# EAGLE design Harp Motor H2-module v1.0 (EAGLE 9.6.2)
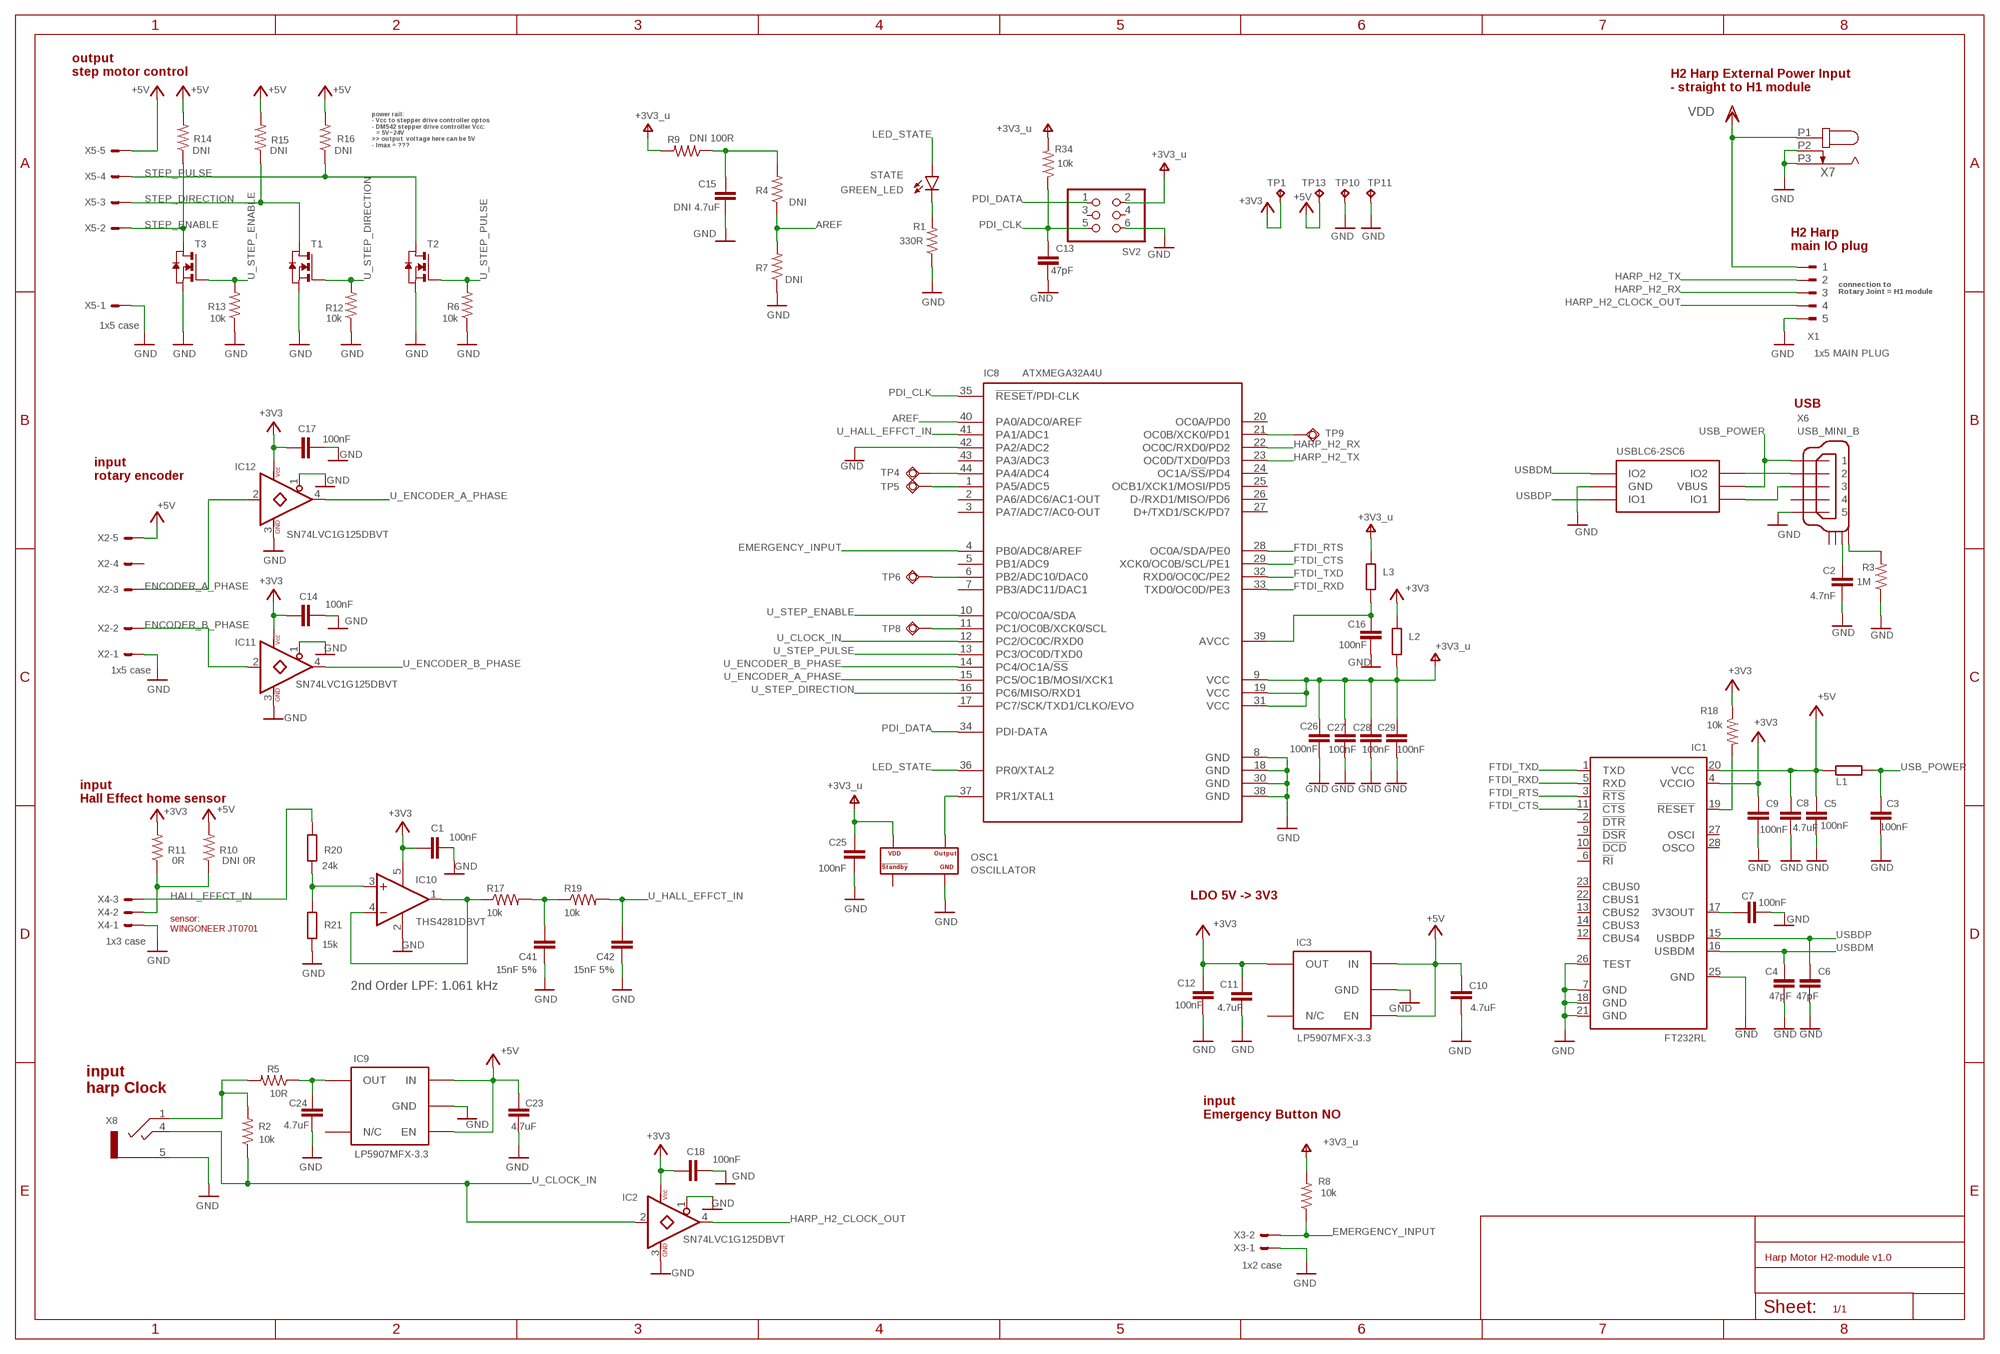
[diagram p0: schematic, sheet 1]

## Parts
C1  100nF  C-EUC0402K  [C0402K]
C2  4.7nF  C-EUC0402K  [C0402K]
C3  100nF  C-EUC0402K  [C0402K]
C4  47pF  C-EUC0402K  [C0402K]
C5  100nF  C-EUC0402K  [C0402K]
C6  47pF  C-EUC0402K  [C0402K]
C7  100nF  C-EUC0402K  [C0402K]
C8  4.7uF  C-EUC0603K  [C0603K]
C9  100nF  C-EUC0402K  [C0402K]
C10  4.7uF  C-EUC0603K  [C0603K]
C11  4.7uF  C-EUC0603K  [C0603K]
C12  100nF  C-EUC0402K  [C0402K]
C13  47pF  C-EUC0402K  [C0402K]
C14  100nF  C-EUC0402K  [C0402K]
C15  DNI 4.7uF  C-EUC0603K  [C0603K]
C16  100nF  C-EUC0402K  [C0402K]
C17  100nF  C-EUC0402K  [C0402K]
C18  100nF  C-EUC0402K  [C0402K]
C23  4.7uF  C-EUC0603K  [C0603K]
C24  4.7uF  C-EUC0603K  [C0603K]
C25  100nF  C-EUC0402K  [C0402K]
C26  100nF  C-EUC0402K  [C0402K]
C27  100nF  C-EUC0402K  [C0402K]
C28  100nF  C-EUC0402K  [C0402K]
C29  100nF  C-EUC0402K  [C0402K]
C41  15nF 5%  C-EUC0402K  [C0402K]
C42  15nF 5%  C-EUC0402K  [C0402K]
IC1  FT232RL  [SSOP28]
IC2  SN74LVC1G125DBVT  74LVC1G125DBV  [SOT23-5]
IC3  LP5907MFX-3.3  TLV700XX  [TSOT23-5]
IC7  USBLC6-2SC6  [SOT23-6L]
IC8  ATXMEGA32A4U  XMEGA-A4_AT-XMEGA-XXA4-AUTQFP44  [TQFP44]
IC9  LP5907MFX-3.3  TLV700XX  [TSOT23-5]
IC10  THS4281DBVT  OPA365  [SOT23-5]
IC11  SN74LVC1G125DBVT  74LVC1G125DBV  [SOT23-5]
IC12  SN74LVC1G125DBVT  74LVC1G125DBV  [SOT23-5]
L1  40R@100MHz  R-EU_R0805  [R0805]
L2  40R@100MHz  R-EU_R0805  [R0805]
L3  40R@100MHz  R-EU_R0805  [R0805]
OSC1  OSCILLATOR  [OSCILLATOR_3.2X2.5]
R1  330R  R-US_R0402  [R0402]
R2  10k  R-US_R0402  [R0402]
R3  1M  R-US_R0402  [R0402]
R4  DNI  R-US_R0402  [R0402]
R5  10R  R-US_R0402  [R0402]
R6  10k  R-US_R0402  [R0402]
R7  DNI  R-US_R0402  [R0402]
R8  10k  R-US_R0402  [R0402]
R9  DNI 100R  R-US_R0402  [R0402]
R10  DNI 0R  R-US_R0402  [R0402]
R11  0R  R-US_R0402  [R0402]
R12  10k  R-US_R0402  [R0402]
R13  10k  R-US_R0402  [R0402]
R14  DNI  R-US_R0402  [R0402]
R15  DNI  R-US_R0402  [R0402]
R16  DNI  R-US_R0402  [R0402]
R17  10k  R-US_R0402  [R0402]
R18  10k  R-US_R0402  [R0402]
R19  10k  R-US_R0402  [R0402]
R20  24k  R-EU_R0402  [R0402]
R21  15k  R-EU_R0402  [R0402]
R34  10k  R-US_R0402  [R0402]
STATE  GREEN_LED  LEDCHIP-LED0603  [CHIP-LED0603]
SV2  PINHD-2X3  [2X03]
T1  DMG1012UW  DMG1012UW-7  [SOT323]
T2  DMG1012UW  DMG1012UW-7  [SOT323]
T3  DMG1012UW  DMG1012UW-7  [SOT323]
TP1  NO_COMPONENT  TPB1,27  [B1,27]
TP4  NO_COMPONENT  TPSQTP11R  [TP11R]
TP5  NO_COMPONENT  TPSQTP11R  [TP11R]
TP6  NO_COMPONENT  TPSQTP11R  [TP11R]
TP8  NO_COMPONENT  TPSQTP11R  [TP11R]
TP9  NO_COMPONENT  TPSQTP11R  [TP11R]
TP10  NO_COMPONENT  TPB1,27  [B1,27]
TP11  NO_COMPONENT  TPB1,27  [B1,27]
TP13  NO_COMPONENT  TPB1,27  [B1,27]
X1  1x5 MAIN PLUG  90G-5  [90G-5]
X2  1x5 case  22-23-2051  [22-23-2051]
X3  1x2 case  22-23-2021  [22-23-2021]
X4  1x3 case  22-23-2031  [22-23-2031]
X5  1x5 case  22-23-2051  [22-23-2051]
X6  USB_MINI_B  [240-0002-1]
X7  DC_JACK2.1MM  [DC_POWER_INPUT_2.1MM]
X8  CLCK_JACK  STEREO_JACK  [35RASMT2BHNTRX]

## Nets
+3V3: C1.1 C9.1 C11.1 C12.1 C14.1 C17.1 C18.1 IC1.4(VCCIO) IC2.5(VCC) IC3.5(OUT) IC10.5(V+) IC11.5(VCC) IC12.5(VCC) L2.2 R11.2 R18.1 TP1.TP
+5V: C5.1 C8.1 C10.1 C23.1 IC1.20(VCC) IC3.1(IN) IC3.3(EN) IC9.1(IN) IC9.3(EN) L1.1 R10.2 R14.2 R15.2 R16.2 TP13.TP X2.5 X5.5
AREF: IC8.40(PA0/ADC0/AREF) R4.1 R7.2
EMERGENCY_INPUT: IC8.4(PB0/ADC8/AREF) R8.1 X3.2
ENCODER_A_PHASE: IC12.2(I) X2.3
ENCODER_B_PHASE: IC11.2(I) X2.2
FTDI_CTS: IC1.11(!CTS) IC8.29(XCK0/OC0B/SCL/PE1)
FTDI_RTS: IC1.3(!RTS) IC8.28(OC0A/SDA/PE0)
FTDI_RXD: IC1.5(RXD) IC8.33(TXD0/OC0D/PE3)
FTDI_TXD: IC1.1(TXD) IC8.32(RXD0/OC0C/PE2)
GND: C1.2 C2.2 C3.2 C4.2 C5.2 C6.2 C7.2 C8.2 C9.2 C10.2 C11.2 C12.2 C13.2 C14.2 C15.2 C16.2 C17.2 C18.2 C23.2 C24.2 C25.2 C26.2 C27.2 C28.2 C29.2 C41.1 C42.1 IC1.7(GND) IC1.18(GND) IC1.21(GND) IC1.25(GND) IC1.26(TEST) IC2.1(OE) IC2.3(GND) IC3.2(GND) IC7.P$2(GND) IC8.8(GND) IC8.18(GND) IC8.30(GND) IC8.38(GND) IC8.42(PA2/ADC2) IC9.2(GND) IC10.2(V-) IC11.1(OE) IC11.3(GND) IC12.1(OE) IC12.3(GND) OSC1.P$2(GND) R1.1 R3.1 R6.1 R7.1 R12.1 R13.1 R21.1 SV2.6 T1.2(S) T2.2(S) T3.2(S) TP10.TP TP11.TP X1.5 X2.1 X3.1 X4.1 X5.1 X6.P$5 X7.P2 X7.P3 X8.5
HALL_EFFCT_IN: R20.2 X4.3
HARP_H2_CLOCK_OUT: IC2.4(O) X1.4
HARP_H2_RX: IC8.22(OC0C/RXD0/PD2) X1.3
HARP_H2_TX: IC8.23(OC0D/TXD0/PD3) X1.2
LED_STATE: IC8.36(PR0/XTAL2) STATE.A
N$1: R3.2 X6.SHIELD_4
N$2: IC7.P$4(IO2) X6.P$2
N$3: IC7.P$6(IO1) X6.P$3
N$9: R1.2 STATE.C
N$11: IC8.44(PA4/ADC4) TP4.TP
N$12: IC8.1(PA5/ADC5) TP5.TP
N$13: IC8.6(PB2/ADC10/DAC0) TP6.TP
N$15: C2.1 X6.SHIELD_3
N$17: IC8.11(PC1/OC0B/XCK0/SCL) TP8.TP
N$18: IC8.21(OC0B/XCK0/PD1) TP9.TP
N$38: C7.1 IC1.17(3V3OUT)
N$50: C41.2 R17.2 R19.1
N$51: R10.1 R11.1 X4.2
N$62: C15.1 R4.2 R9.1
N$63: C16.1 IC8.39(AVCC) L3.1
N$64: IC10.1(OUT) IC10.4(-IN) R17.1
N$65: IC10.3(+IN) R20.1 R21.2
N$103: R2.2 R5.2 X8.1
N$104: C24.1 IC9.5(OUT) R5.1
N$175: IC1.19(!RESET) R18.2
OSC2: IC8.37(PR1/XTAL1) OSC1.P$3(OUTPUT)
PDI_CLK: C13.1 IC8.35(!RESET!/PDI-CLK) R34.1 SV2.5
PDI_DATA: IC8.34(PDI-DATA) SV2.1
STEP_DIRECTION: R15.1 T1.3(D) X5.3
STEP_ENABLE: R14.1 T3.3(D) X5.2
STEP_PULSE: R16.1 T2.3(D) X5.4
U_CLOCK_IN: IC2.2(I) IC8.12(PC2/OC0C/RXD0) R2.1 X8.4
U_ENCODER_A_PHASE: IC8.15(PC5/OC1B/MOSI/XCK1) IC12.4(O)
U_ENCODER_B_PHASE: IC8.14(PC4/OC1A/!SS) IC11.4(O)
U_HALL_EFFCT_IN: C42.2 IC8.41(PA1/ADC1) R19.2
U_STEP_DIRECTION: IC8.16(PC6/MISO/RXD1) R12.2 T1.1(G)
U_STEP_ENABLE: IC8.10(PC0/OC0A/SDA) R13.2 T3.1(G)
U_STEP_PULSE: IC8.13(PC3/OC0D/TXD0) R6.2 T2.1(G)
USB_POWER: C3.1 IC7.P$5(VBUS) L1.2 X6.P$1
USBDM: C4.1 IC1.16(USBDM) IC7.P$3(IO2)
USBDP: C6.1 IC1.15(USBDP) IC7.P$1(IO1)
V+: C25.1 C26.1 C27.1 C28.1 C29.1 IC8.9(VCC) IC8.19(VCC) IC8.31(VCC) L2.1 L3.2 OSC1.P$4(VDD) R8.2 R9.2 R34.2 SV2.2 ; supply symbol labelled +3V3_u
VDD: X1.1 X7.P1
Unconnected: IC1.2(!DTR) IC1.6(!RI) IC1.9(!DSR) IC1.10(!DCD) IC1.12(CBUS4) IC1.13(CBUS2) IC1.14(CBUS3) IC1.22(CBUS1) IC1.23(CBUS0) IC1.27(OSCI) IC1.28(OSCO) IC3.4(N/C) IC8.2(PA6/ADC6/AC1-OUT) IC8.3(PA7/ADC7/AC0-OUT) IC8.5(PB1/ADC9) IC8.7(PB3/ADC11/DAC1) IC8.17(PC7/SCK/TXD1/CLKO/EVO) IC8.20(OC0A/PD0) IC8.24(OC1A/!SS!/PD4) IC8.25(OCB1/XCK1/MOSI/PD5) IC8.26(D-/RXD1/MISO/PD6) IC8.27(D+/TXD1/SCK/PD7) IC8.43(PA3/ADC3) IC9.4(N/C) OSC1.P$1(STANDBY#) SV2.3 SV2.4 X2.4 X6.P$4 X6.SHIELD_1 X6.SHIELD_2

## Notes on the sheet
- output
  step motor control
- H2 Harp External Power Input
  - straight to H1 module
- power rail:
  - Vcc to stepper drive controller optos
  - DM542 stepper drive controller Vcc: 
     = 5V~24V
  >> output  voltage here can be 5V
  - Imax = ???
- H2 Harp 
  main IO plug
- connection to 
  Rotary Joint = H1 module
- USB
- input
  rotary encoder
- input
  Hall Effect home sensor
- LDO 5V -> 3V3
- sensor:
  WINGONEER JT0701
- 2nd Order LPF: 1.061 kHz
- input
  harp Clock
- input
  Emergency Button NO

## Library data of the parts
C1 C3 C5 C7 C9 C12 C14 C16-C18 C25-C29 = Harp Motor H2-module v1.0:C-EU: CAPACITOR, European symbol; MPN: C1005X7R1H104K050BB; OEPS: OEPS010004
C2 = Harp Motor H2-module v1.0:C-EU: CAPACITOR, European symbol; MPN: CC0402KRX7R8BB472; OEPS: OEPS010001
C4 C6 C13 = Harp Motor H2-module v1.0:C-EU: CAPACITOR, European symbol; MPN: 04025A470JAT2A; OEPS: OEPS010011
C8 C10 C11 C15 C23 C24 = Harp Motor H2-module v1.0:C-EU: CAPACITOR, European symbol; MPN: C1608X6S1C475K080AC; OEPS: OEPS010018
C41 C42 = Harp Motor H2-module v1.0:C-EU: CAPACITOR, European symbol; MPN: CGA2B3X7R1V153K050BB; OEPS: OEPS010023
IC1 = Harp Motor H2-module v1.0:FT232R: UART/FIFO IC; MPN: FT232RL; OEPS: OEPS080013
IC2 IC11 IC12 = Harp Motor H2-module v1.0:74*1G125: Single Bus Buffer Gate with 3-State Output; MPN: SN74LVC1G125DBVT; OEPS: OEPS080029
IC3 IC9 = Harp Motor H2-module v1.0:TLV700XX: C REG LINEAR 3.3V 200MA SOT23-5; MPN: LP5907MFX-3.3/NOPB; OEPS: OEPS080016
IC7 = Harp Motor H2-module v1.0:USBLC6-2SC6: TVS DIODE 5.25VWM 17VC SOT23-6; MPN: USBLC6-2SC6; OEPS: OEPS030010
IC8 = Harp Motor H2-module v1.0:XMEGA-A4_AT-XMEGA-XXA4-AU: ATxMega a4 Serie; MPN: ATXMEGA32A4U-AUR; OEPS: OEPS080012
IC10 = Harp Motor H2-module v1.0:OPA365; MPN: THS4281DBVT; OEPS: OEPS080038
L1-L3 = Harp Motor H2-module v1.0:R-EU_: RESISTOR, European symbol; MPN: MI0805K400R-10; OEPS: OEPS040003
OSC1 = Harp Motor H2-module v1.0:OSCILLATOR: XTAL OSC TCXO 32.0000MHZ HCMOS; MPN: DSC1001CI5-032.0000; OEPS: OEPS080018
R1 = Harp Motor H2-module v1.0:R-US_: RESISTOR, American symbol; MPN: RC0402FR-07330RL; OEPS: OEPS020037
R2 R6 R8 R12 R13 R17-R19 R34 = Harp Motor H2-module v1.0:R-US_: RESISTOR, American symbol; MPN: CRCW040210K0FKED; OEPS: OEPS020030
R3 = Harp Motor H2-module v1.0:R-US_: RESISTOR, American symbol; MPN: CRCW04021M00FKED; OEPS: OEPS020026
R4 R7 R14-R16 = Harp Motor H2-module v1.0:R-US_: RESISTOR, American symbol; MPN: DNI; OEPS: DNI
R5 = Harp Motor H2-module v1.0:R-US_: RESISTOR, American symbol; MPN: ERJ-PA2J100X; OEPS: OEPS020041
R9 = Harp Motor H2-module v1.0:R-US_: RESISTOR, American symbol; MPN: ERJ-2RKF1000X; OEPS: OEPS020004
R10 R11 = Harp Motor H2-module v1.0:R-US_: RESISTOR, American symbol; MPN: RC0402JR-070RL; OEPS: OEPS020001
R20 = Harp Motor H2-module v1.0:R-EU_: RESISTOR, European symbol; MPN: ERJ-2RKF2402X; OEPS: OEPS020048
R21 = Harp Motor H2-module v1.0:R-EU_: RESISTOR, European symbol; MPN: ERJ-2RKF1502X; OEPS: OEPS020015
STATE = Harp Motor H2-module v1.0:LED; MPN: LTST-C191KGKT; OEPS: OEPS030005
SV2 = Harp Motor H2-module v1.0:PINHD-2X3: PIN HEADER; MPN: 609-3210-ND; OEPS: OEPS070015
T1-T3 = Harp Motor H2-module v1.0:DMG1012UW-7: N-CHANNEL ENHANCEMENT MODE MOSFET; MPN: DMG1012UW-7; OEPS: OEPS060010
TP1 TP10 TP11 TP13 = Harp Motor H2-module v1.0:TP: Test pad
TP4-TP6 TP8 TP9 = Harp Motor H2-module v1.0:TPSQ: Test pad
X1 = Harp Motor H2-module v1.0:90G-5: WEIDMUELLER CLAMP CONNECTOR; MPN: 20.155MH/5-E; OEPS: OEPS070037
X2 X5 = Harp Motor H2-module v1.0:22-23-2051: .100" (2.54mm) Center Header - 5 Pin; MPN: 282834-5; OEPS: OEPS070041
X3 = Harp Motor H2-module v1.0:22-23-2021: .100" (2.54mm) Center Header - 2 Pin; MPN: 282834-2; OEPS: OEPS070020
X4 = Harp Motor H2-module v1.0:22-23-2031: .100" (2.54mm) Center Header - 3 Pin; MPN: 282834-3; OEPS: OEPS070035
X6 = Harp Motor H2-module v1.0:USB_MINI_B: CONN RCPT USB2.0 MINI B SMD R/A; MPN: UX60-MB-5S8; OEPS: OEPS070021
X7 = Harp Motor H2-module v1.0:DC_JACK: DC Power Connectors PCB 2.1MM; MPN: 163-179PH-EX; OEPS: OEPS070026
X8 = Harp Motor H2-module v1.0:STEREO_JACK: CONN JACK STEREO 3.5MM SMD R/A; MPN: 35RASMT2BHNTRX; OEPS: OEPS070025

## Net classes
0 default: clearance 0.205 mm

## Board
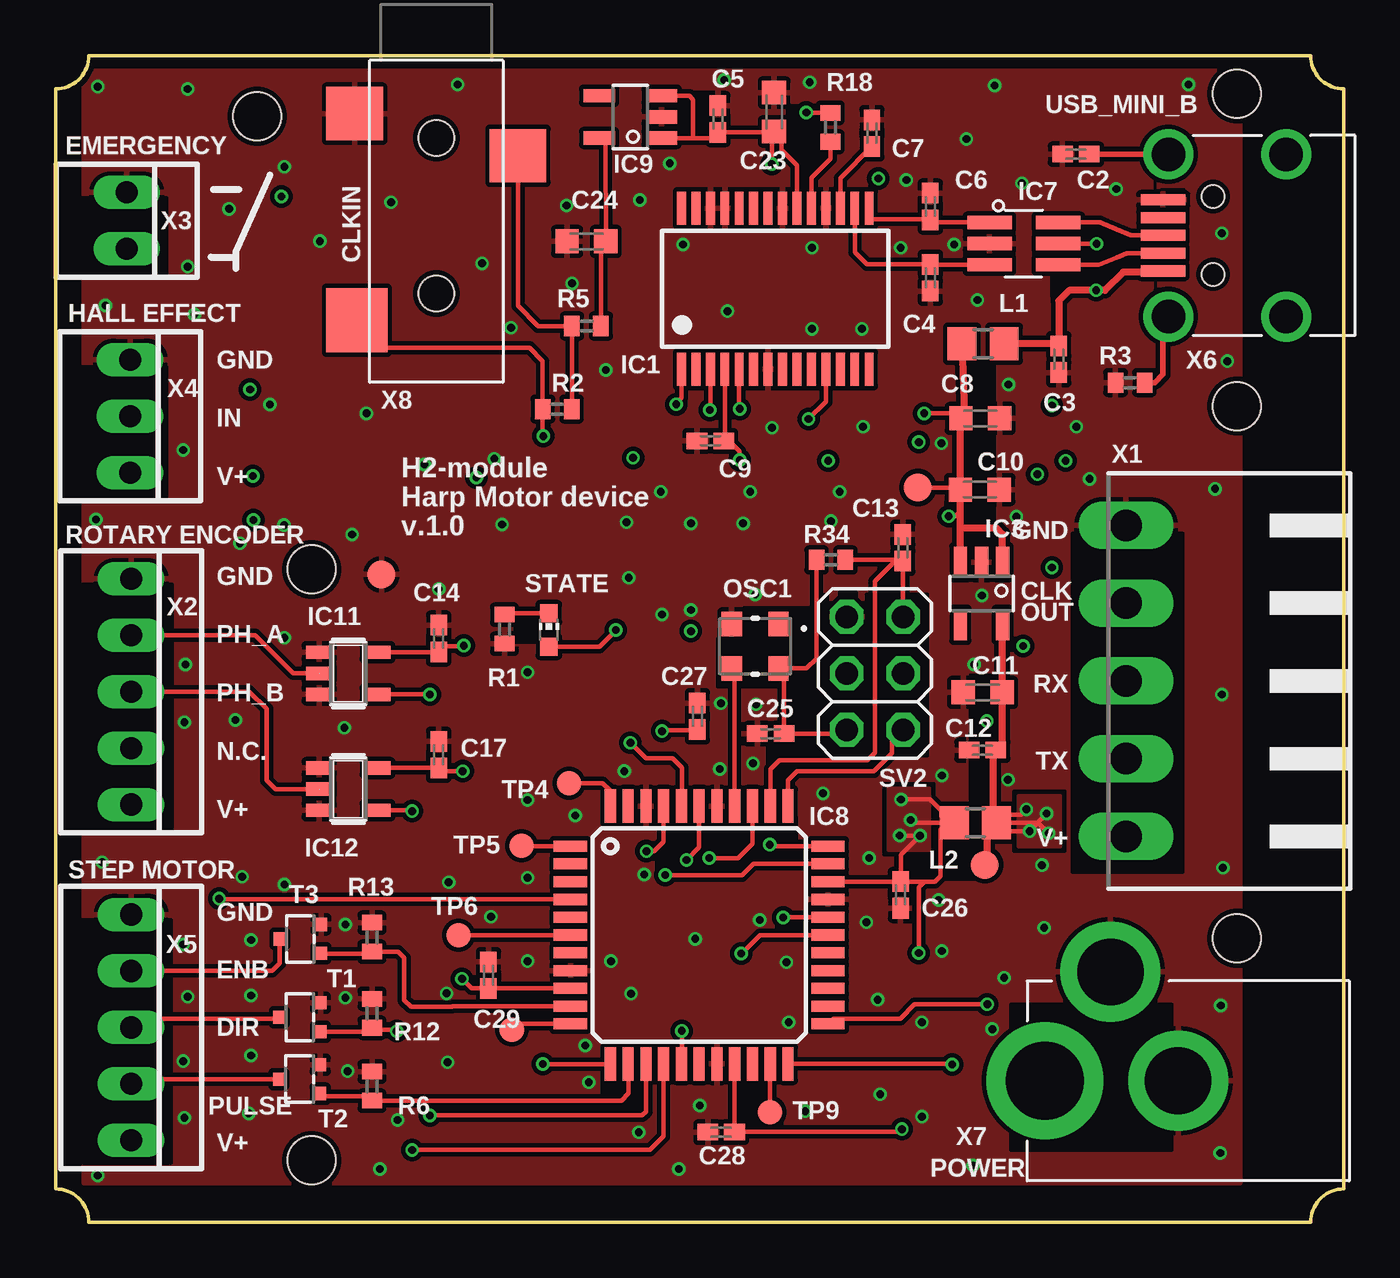
[diagram p1: board, top side]
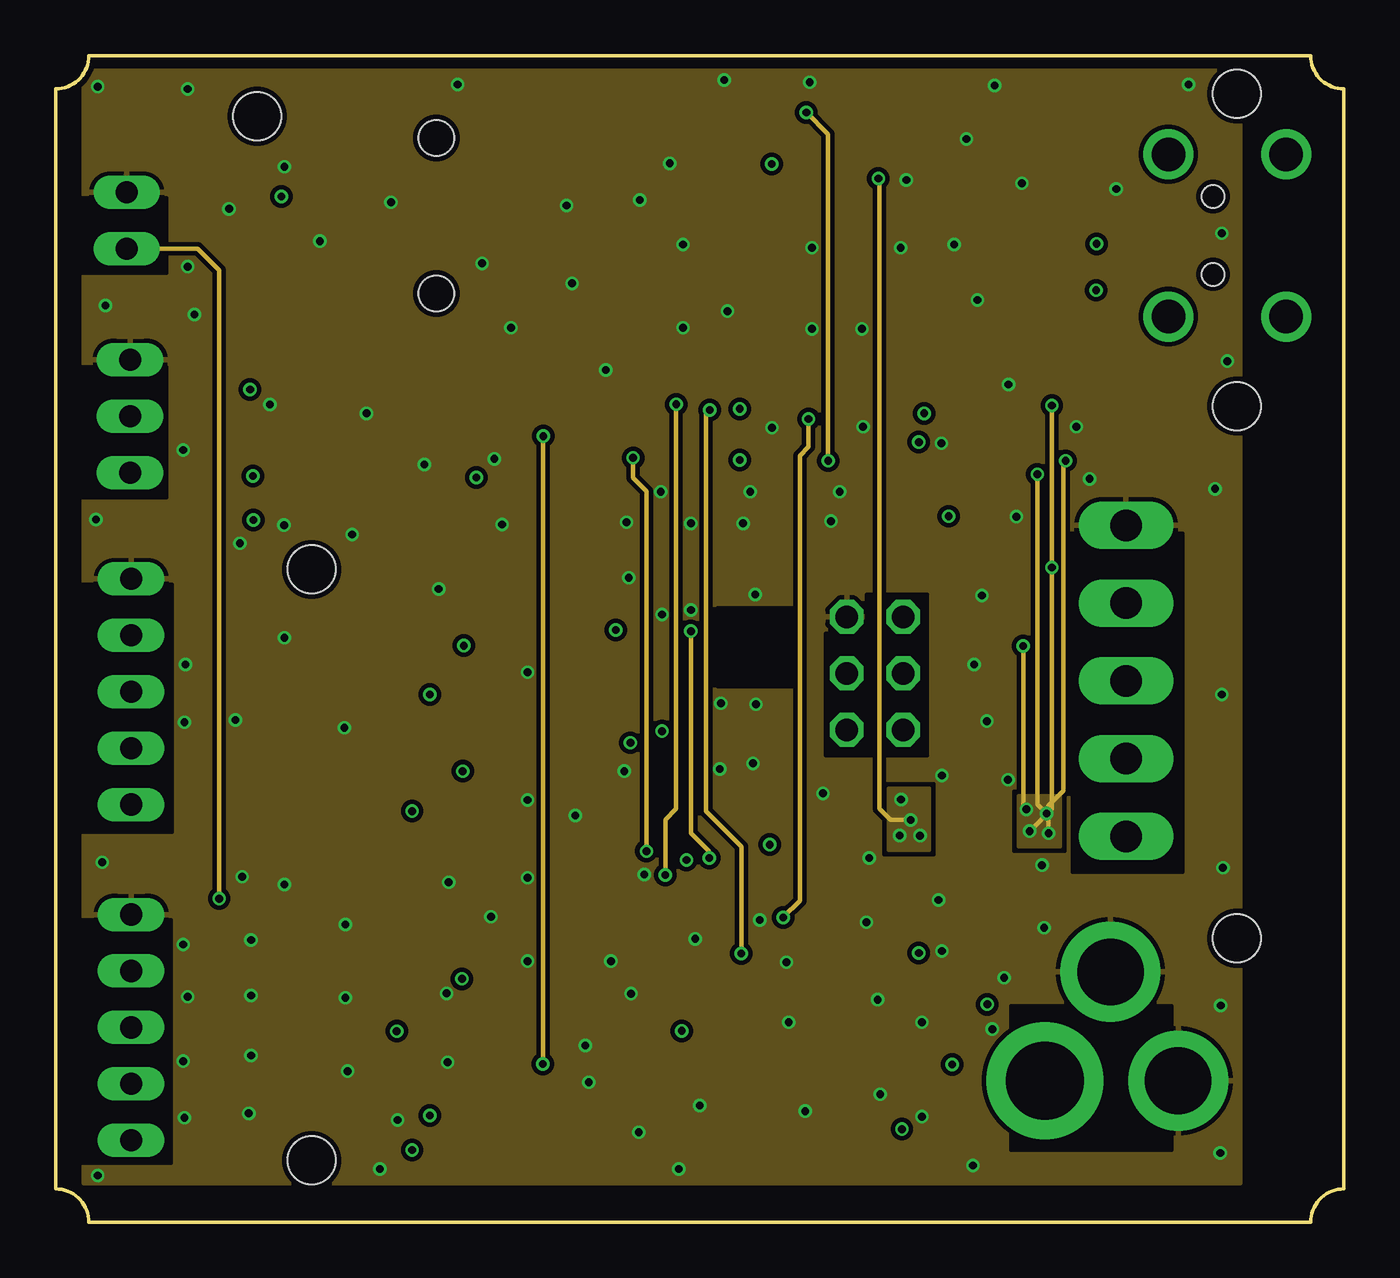
[diagram p2: board, inner layer Route2]
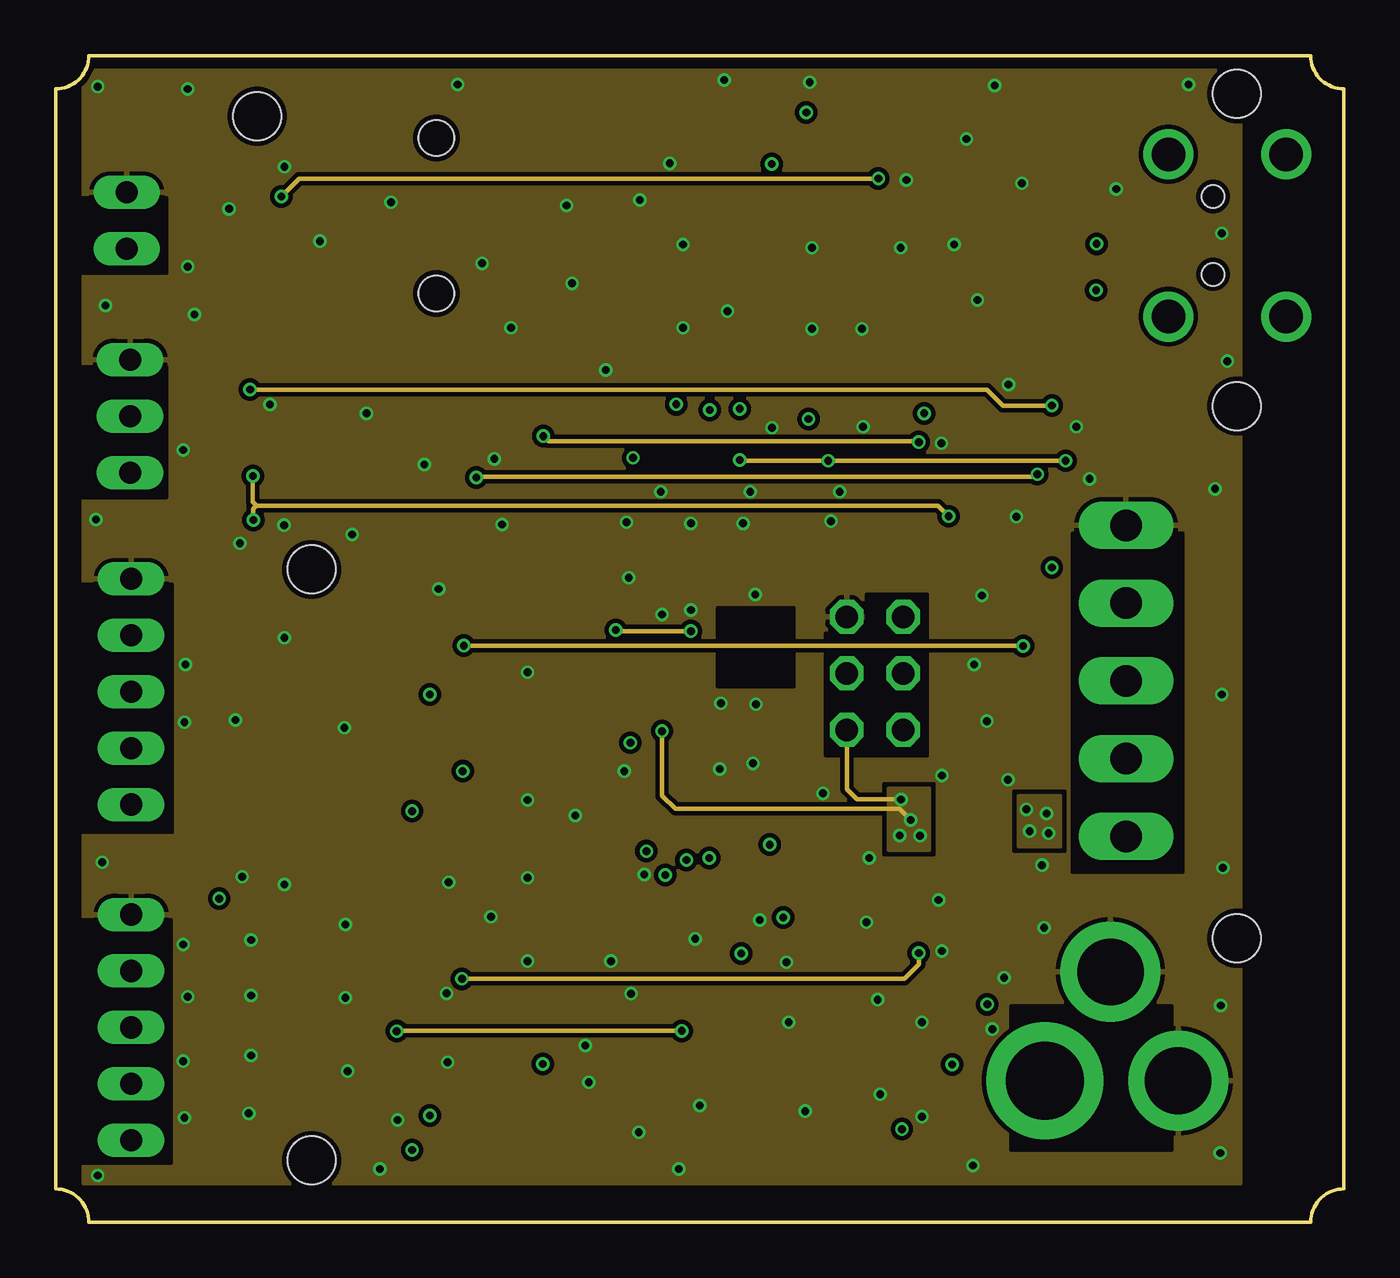
[diagram p3: board, inner layer Route15]
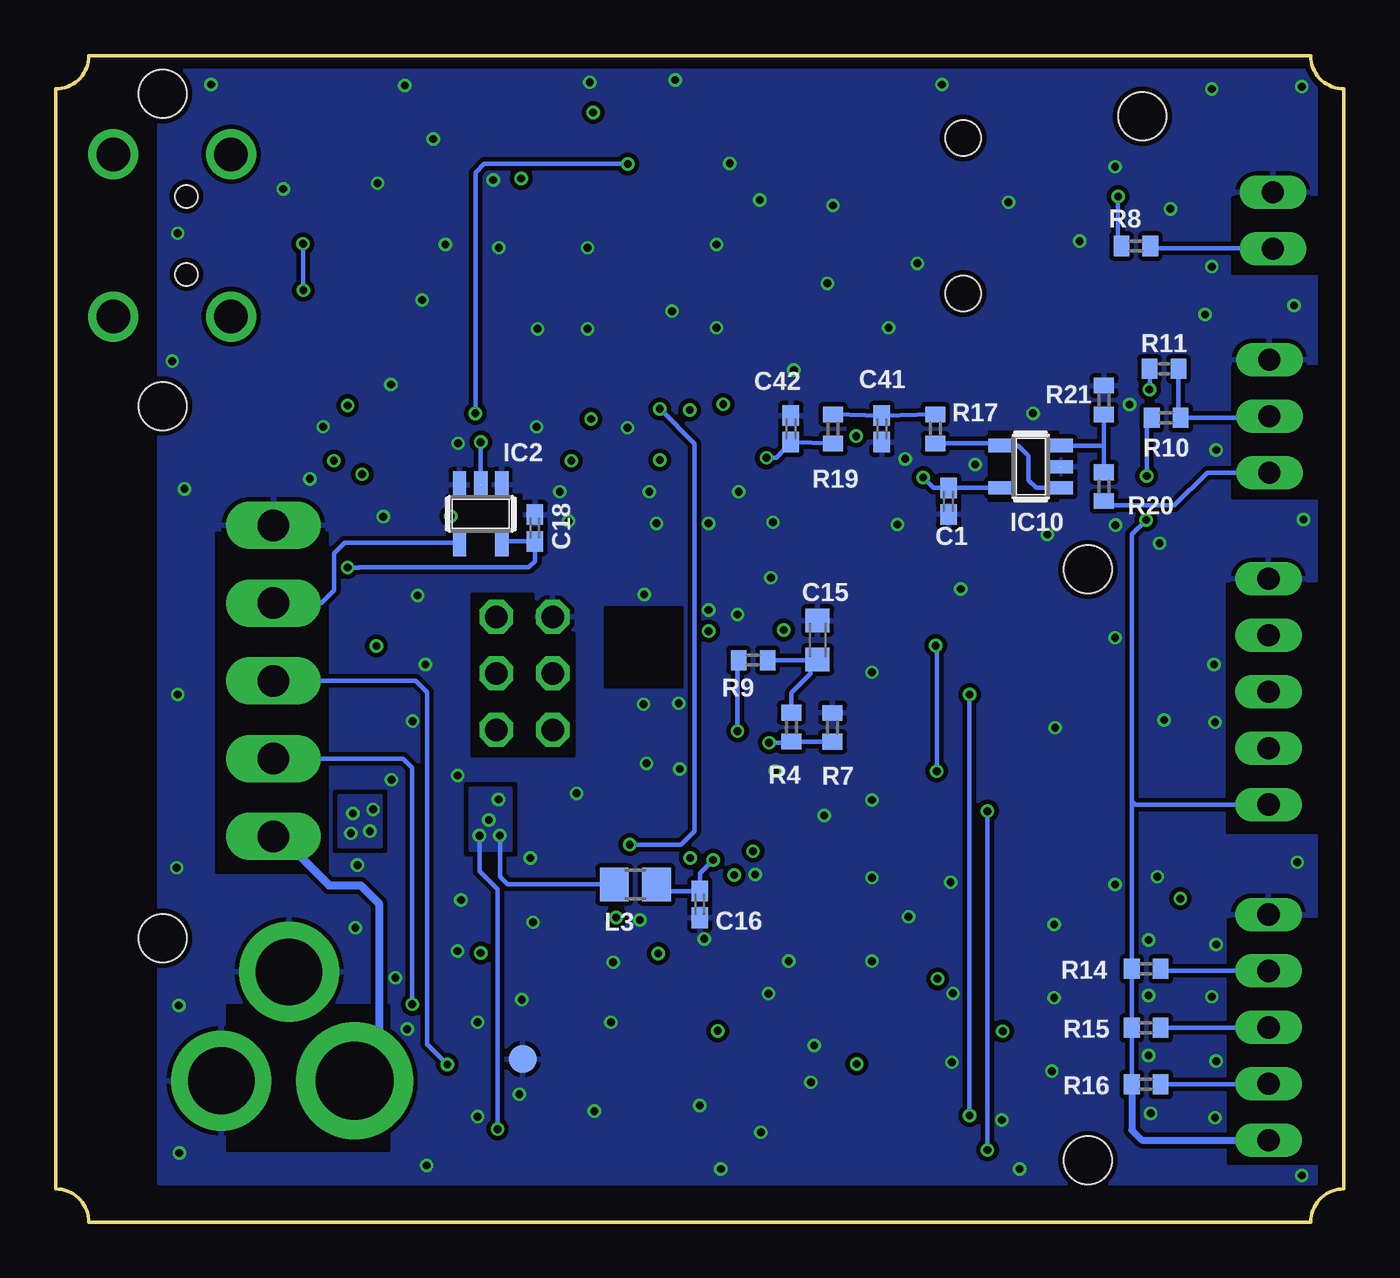
[diagram p4: board, bottom side, seen from below]

Size 58 x 52.5 mm. Coordinates in mm from the lower left corner, seen from the top.
Outline: 56.5,52.5 1.5,52.5 arc-90 0,51 0,1.5 arc-90 1.5,0 56.5,0 arc-90 58,1.5 58,51 arc-90 56.5,52.5
Copper layers (1+2*15+16): Top 0.018mm / dielectric 0.36mm / Route2 0.035mm / dielectric 0.71mm / Route15 0.035mm / dielectric 0.2mm / Bottom 0.018mm
Design rules "my design rules *": minimum track width 0.15mm, minimum drill 0.35mm, track to track 6mil, track to pad 6mil, pad to pad 6mil, via to via 6mil, smd to smd 6mil, copper to edge 0.25mm, drill to drill 0.35mm, minimum pad ring 0.175mm, minimum via ring 0.125mm, stop-mask expansion 0mil, vias tented up to drill 0.45mm, thermal gap 0.2mm
Holes 2.15 mm at 11.53,2.78 9.08,49.78 53.17,12.78 53.17,36.73 53.17,50.78 11.53,29.37

### Footprints (pad centres in the part's own frame; a part is rotated, then mirrored left to right if it is on the bottom)
C0402K = smd 0.925 x 0.74: 1 -0.6,0; 2 0.6,0
C0603K = smd 1.05 x 1.08: 1 -0.875,0; 2 0.875,0
SSOP28 = smd 0.4 x 1.5: 1 -4.225,-3.625; 2 -3.575,-3.625; 3 -2.925,-3.625; 4 -2.275,-3.625; 5 -1.625,-3.625; 6 -0.975,-3.625; 7 -0.325,-3.625; 8 0.325,-3.625; 9 0.975,-3.625; 10 1.625,-3.625; 11 2.275,-3.625; 12 2.925,-3.625; 13 3.575,-3.625; 14 4.225,-3.625; 15 4.225,3.625; 16 3.575,3.625; 17 2.925,3.625; 18 2.275,3.625; 19 1.625,3.625; 20 0.975,3.625; 21 0.325,3.625; 22 -0.325,3.625; 23 -0.975,3.625; 24 -1.625,3.625; 25 -2.275,3.625; 26 -2.925,3.625; 27 -3.575,3.625; 28 -4.225,3.625
SOT23-5 = smd 0.6 x 1.2: 1 -0.95,-1.306; 2 0,-1.306; 3 0.95,-1.306; 4 0.95,1.306; 5 -0.95,1.306
TSOT23-5 = smd 0.6 x 1.408: 1 -0.95,-1.404; 2 0,-1.404; 3 0.95,-1.404; 4 0.95,1.404; 5 -0.95,1.404
SOT23-6L = smd 0.6 x 2: P$1 -0.95,-1.55; P$2 0,-1.55; P$3 0.95,-1.55; P$4 0.95,1.55; P$5 0,1.55; P$6 -0.95,1.55
TQFP44 = smd 1.5 x 0.5: 1 -5.8,4; 2 -5.8,3.2; 3 -5.8,2.4; 4 -5.8,1.6; 5 -5.8,0.8; 6 -5.8,0; 7 -5.8,-0.8; 8 -5.8,-1.6; 9 -5.8,-2.4; 10 -5.8,-3.2; 11 -5.8,-4; 23 5.8,-4; 24 5.8,-3.2; 25 5.8,-2.4; 26 5.8,-1.6; 27 5.8,-0.8; 28 5.8,0; 29 5.8,0.8; 30 5.8,1.6; 31 5.8,2.4; 32 5.8,3.2; 33 5.8,4 | smd 0.5 x 1.5: 12 -4,-5.8; 13 -3.2,-5.8; 14 -2.4,-5.8; 15 -1.6,-5.8; 16 -0.8,-5.8; 17 0,-5.8; 18 0.8,-5.8; 19 1.6,-5.8; 20 2.4,-5.8; 21 3.2,-5.8; 22 4,-5.8; 34 4,5.8; 35 3.2,5.8; 36 2.4,5.8; 37 1.6,5.8; 38 0.8,5.8; 39 0,5.8; 40 -0.8,5.8; 41 -1.6,5.8; 42 -2.4,5.8; 43 -3.2,5.8; 44 -4,5.8
R0805 = smd 1.3 x 1.5: 1 -0.95,0; 2 0.95,0
OSCILLATOR_3.2X2.5 = smd 0.9 x 1.1: P$1 -1.05,-1; P$2 1.05,-1; P$3 1.05,1; P$4 -1.05,1
R0402 = smd 0.7 x 0.9: 1 -0.65,0; 2 0.65,0
CHIP-LED0603 = smd 0.8 x 0.8: A 0,-0.75; C 0,0.75
2X03 = drill 1.016 octagon: 1 -2.54,-1.27; 2 -2.54,1.27; 3 0,-1.27; 4 0,1.27; 5 2.54,-1.27; 6 2.54,1.27
SOT323 = smd 0.6 x 0.55: 1 -0.65,-0.925; 2 0.65,-0.925; 3 0,0.925
B1,27 = smd 1.27 x 1.27: TP 0,0
TP11R = smd 1.1 x 1.1: TP 0,0
90G-5 = drill 1.422 long: 1 -7,5.25; 2 -3.5,5.25; 3 0,5.25; 4 3.5,5.25; 5 7,5.25
22-23-2051 = drill 1 long: 1 -5.08,0; 2 -2.54,0; 3 0,0; 4 2.54,0; 5 5.08,0
22-23-2021 = drill 1 long: 1 -1.27,0; 2 1.27,0
22-23-2031 = drill 1 long: 1 -2.54,0; 2 0,0; 3 2.54,0
240-0002-1 = smd 0.5 x 2: P$1 -1.6,8.65; P$2 -0.8,8.65; P$3 0,8.65; P$4 0.8,8.65; P$5 1.6,8.65 | drill 1.5: SHIELD_1 -3.65,3.1; SHIELD_2 3.65,3.1; SHIELD_3 3.65,8.4; SHIELD_4 -3.65,8.4 | hole 1: -1.75,6.4; 1.75,6.4
DC_POWER_INPUT_2.1MM = drill 3.5: P1 8.5,0 | drill 3: P2 2.5,0; P3 5.55,-4.9
35RASMT2BHNTRX = smd 2.4 x 2.55: 1 0.8,3.675; 5 -1.1,-3.675 | smd 2.9 x 2.75: 4 8.2,-3.575 | hole 1.6: 0,0; 7,0

### Placement (x,y rotation side)
C1  17.8,32.45 270 bottom
C2  45.93,48.07 180 top
C3  45.16,38.83 270 top
C4  39.38,42.5 270 top
C5  29.82,49.64 90 top
C6  39.38,45.71 90 top
C7  36.75,49.01 90 top
C8  41.63,36.17 0 top
C9  29.48,35.16 180 top
C10  41.61,32.96 0 top
C11  41.74,23.85 180 top
C12  41.73,21.24 180 top
C13  38.14,30.35 90 top
C14  17.25,26.27 90 top
C15  23.7,26.2 90 bottom
C16  29,14.3 270 bottom
C17  17.25,21.03 90 top
C18  36.42,31.24 90 bottom
C23  32.35,49.96 90 top
C24  23.9,44.14 180 top
C25  32.2,21.98 180 top
C26  38.04,14.73 270 top
C27  28.89,22.76 90 top
C28  29.96,4.06 180 top
C29  19.49,11.12 90 top
C41  20.8,35.7 90 bottom
C42  24.9,35.7 270 bottom
IC1  32.4,42.01 0 top
IC2  38.86,31.88 180 bottom
IC3  41.69,28.29 180 top
IC7  43.59,44.04 270 top
IC8  28.97,12.92 0 top
IC9  25.88,49.74 90 top
IC10  14.1,34 90 bottom
IC11  13.18,24.7 270 top
IC12  13.18,19.49 270 top
L1  41.75,39.53 0 top
L2  41.41,17.98 0 top
L3  31.9,15.2 180 bottom
OSC1  31.49,25.92 180 top
R1  20.21,26.69 90 top
R2  22.58,36.58 0 top
R3  48.37,37.78 0 top
R4  24.88,22.28 90 bottom
R5  23.9,40.33 180 top
R6  14.25,6.12 270 top
R7  23.02,22.27 270 bottom
R8  9.37,43.93 180 bottom
R9  26.6,25.3 180 bottom
R10  8,36.2 180 bottom
R11  8.1,38.4 180 bottom
R12  14.25,9.4 270 top
R13  14.25,12.83 270 top
R14  8.9,11.4 180 bottom
R15  8.9,8.75 180 bottom
R16  8.9,6.2 180 bottom
R17  18.4,35.7 90 bottom
R18  34.87,49.27 270 top
R19  23,35.7 270 bottom
R20  10.8,33.1 270 bottom
R21  10.8,37 270 bottom
R34  34.91,29.8 180 top
STATE  22.21,26.65 0 top
SV2  36.89,24.7 90 top
T1  11,9.22 90 top
T2  10.99,6.44 90 top
T3  11.02,12.75 90 top
TP1  41.83,16.08 0 top
TP4  23.11,19.76 0 top
TP5  20.99,16.94 0 top
TP6  18.14,12.92 0 top
TP8  20.54,8.66 0 top
TP9  32.16,4.95 180 top
TP10  14.67,29.15 0 top
TP11  36.97,7.34 0 bottom
TP13  38.81,33.06 0 top
X1  53.44,24.36 90 top
X2  3.4,23.87 270 top
X3  3.2,45.07 270 top
X4  3.36,36.27 270 top
X5  3.4,8.77 270 top
X6  58.5,44.41 90 top
X7  53.04,6.36 180 top
X8  17.14,48.79 270 top

### Tracks (layer width: path | path; a pad name or v marks a point on that pad's centre or on a via)
+3V3  (via drill 0.35)
  Top 0.203: IC12.5 17.24,20.44 C17.1 17.25,20.3 v18.33,20.3 | IC11.5 17.23,25.65 C14.1 17.5,25.92 18.38,25.92 v18.38,25.95 | IC1.4 30.13,35.21 C9.1 30.33,35.16 30.8,34.69 v30.8,34.3 | R18.1 33.81,49.92 v33.8,49.94 | v43.7,18.58 43.45,18.33 42.94,18.33 42.36,17.75 L2.2 | L2.2 42.64,17.6 v43.85,17.6 44.23,17.98 v44.7,17.5 | v44.61,18.4 44.2,17.98 L2.2
  Top 0.305: IC3.5 42.61,26.83 C11.1 42.6,23.84 42.6,21.52 C12.1 42.2,21.11 42.2,18.14 L2.2 41.93,17.55 41.93,16.18 TP1.TP
  Route2 0.203: v33.8,49.94 34.78,48.95 v34.78,34.27 | v43.56,25.93 43.56,18.58 v43.7,18.58 | v44.85,36.75 v44.85,29.46 44.85,18.6 v43.85,17.6 | v45.47,34.27 45.37,34.17 45.37,19.41 44.7,18.75 v44.7,17.5 | v44.2,33.66 44.2,18.81 v44.61,18.4
  Route15 0.15: v18.38,25.95 v18.39,25.95
  Route15 0.203: v18.94,33.52 18.98,33.56 44.09,33.56 v44.2,33.66 | v18.39,25.95 43.54,25.95 v43.56,25.93 | v30.8,34.3 30.83,34.27 v34.78,34.27 v45.47,34.27 | v44.85,36.75 42.65,36.75 41.93,37.47 v8.76,37.47
  Bottom 0.15: 37.91,30.64 IC2.5
  Bottom 0.2: 37.34,30.64 37.91,30.64
  Bottom 0.203: v18.33,20.3 18.33,25.89 v18.38,25.95 | v18.94,33.52 18.47,33.05 C1.1 IC10.5 | v8.76,37.47 v8.75,37.48 R11.2 | 37.34,30.64 C18.1 36.42,29.74 36.7,29.46 44.32,29.46 44.33,29.47 44.34,29.46 v44.85,29.46
  pour Top: 43.35,19.19 45.23,19.19 45.23,16.89 43.35,16.89
  pour Route2: 43.35,19.19 45.23,19.19 45.23,16.89 43.35,16.89
  pour Route15: 43.35,19.19 45.23,19.19 45.23,16.89 43.35,16.89
  pour Bottom: 43.35,19.19 45.23,19.19 45.23,16.89 43.35,16.89
+5V  (via drill 0.35)
  Top 0.203: IC9.1 28.7,48.79 | 28.7,48.79 29.56,48.79 C5.1 32.28,49.04 C23.1 | C23.1 32.24,49 v32.24,47.62 | IC1.20 33.38,47.57 32.68,48.26 32.68,48.77 C23.1 | C8.1 40.55,36.4 v39.1,36.4 | IC9.3 28.54,50.69 28.7,50.52 28.7,48.79 | TP13.TP 40.64,33.06 C10.1 40.73,32 40.5,31.77 v40.21,31.77
  Top 0.305: L1.1 40.9,36.3 C8.1 40.73,36.13 C10.1 40.73,31.22 | IC3.3 40.73,31.22 | IC3.1 42.63,30.96 42.38,31.22 40.73,31.22
  Route15 0.203: v40.21,31.77 39.73,32.25 9.05,32.25 | 9.05,32.25 8.88,32.41 v8.88,33.58 | v8.9,31.6 8.9,32.1 9.05,32.25
  Bottom 0.203: v39.1,36.4 39.1,47.24 38.71,47.62 v32.24,47.62 | 9.55,18.95 9.55,30.95 v8.9,31.6 | R16.2 R15.2 R14.2 9.55,18.95 | v8.88,33.58 8.88,35.97 R10.2 | X2.5 9.4,18.79 9.55,18.95
  Bottom 0.305: R16.2 9.55,4.15 9.1,3.7 3.41,3.7 X5.5
AREF  (via drill 0.35)
  Top 0.203: IC8.40 28.19,18.75 28.19,20.46 27.78,20.88 26.58,20.88 v25.88,21.58
  Bottom 0.203: R7.2 R4.1 | R4.1 | v25.88,21.58 24.92,21.58 R4.1
EMERGENCY_INPUT  (via drill 0.35)
  Top 0.203: IC8.4 7.4,14.52 v7.37,14.56
  Route2 0.203: v7.37,14.56 7.37,42.83 6.39,43.8 X3.2
  Bottom 0.203: X3.2 3.23,43.83 8.62,43.83 R8.1
ENCODER_A_PHASE
  Top 0.203: IC12.2 9.9,19.49 9.5,19.89 9.5,23.1 8.73,23.87 X2.3
ENCODER_B_PHASE
  Top 0.203: IC11.2 10.7,24.7 8.99,26.41 X2.2
FTDI_CTS  (via drill 0.35)
  Top 0.203: IC1.11 34.68,36.93 33.9,36.15 v33.9,36.14 | IC8.29 32.76,13.72 v32.75,13.71
  Route2 0.203: v32.75,13.71 33.5,14.46 33.5,34.5 33.9,34.89 v33.9,36.14
FTDI_RTS  (via drill 0.35)
  Top 0.203: IC1.3 29.48,36.6 29.43,36.56 v29.45,36.55 | v30.87,12.09 31.71,12.92 IC8.28
  Route2 0.203: v29.45,36.55 29.27,36.38 29.27,18.49 30.87,16.89 v30.87,12.09
FTDI_RXD  (via drill 0.35)
  Top 0.203: IC1.5 30.78,36.62 v30.8,36.6 | IC8.33 32.22,16.92 v32.15,16.99
  Bottom 0.203: v32.15,16.99 29.85,16.99 29.24,17.6 29.24,35.04 v30.8,36.6
FTDI_TXD  (via drill 0.35)
  Top 0.203: IC1.1 28.18,37.11 27.91,36.84 v27.94,36.81 | v27.45,15.62 30.91,15.62 31.42,16.12 IC8.32
  Route2 0.203: v27.45,15.62 27.45,18.12 27.94,18.61 v27.94,36.81
GND  (via drill 0.35)
  other vias: 1.82,31.62 42.28,51.15 52.43,3.12 25.91,10.29 42.7,11 44.41,16.07 42.17,8.69 36.63,16.39 31.5,28.25 31.53,23.31 27.3,27.35 40.45,44 36.5,13.5 28.05,2.4 14.6,2.4 29,5.25 33,9 26.5,15.65 5.8,22.5 38.05,43.85 33.95,51.3 30.1,51.4 27.65,47.65 18.1,51.2 15.1,45.9 5.95,51 2.25,41.25 17.25,28.5 20.5,40.25 23.25,42.25 28.25,40.25 28.25,44 30.25,41 36.3,40.2 45.95,35.8 52.2,33 52.75,38.75 43.25,31.75 52.55,15.95 33.75,5 23.85,7.95 13.15,6.8 13.05,10.1 13.05,13.4 5.75,7.25 5.95,10.15 5.75,12.5 6.25,40.85 34.9,31.55 28.6,31.45 19.6,13.75 21.25,11.75 17.65,7.2 17.6,10.3 2.1,16.2 21.25,15.5 13,22.25 39.75,14.5 34.55,19.3 52.5,23.75 41.92,22.55 28.6,27.55 8.4,15.55 41.35,25.1 41.3,2.55 52.45,9.75 44.5,13.25 39,4.75 37.13,5.76 39,9 31.7,13.6 21.25,19 21.25,24.75 30.95,31.45 13.35,30.95 5.75,34.75 7.81,45.6 5.95,43 31.4,20.65 25,11.75 28.8,12.75 9.65,36.8 8.3,30.55 32.25,35.75 36.35,35.8 19.2,43.15 23,45.75 11.9,44.15 19.75,34.35 41,48.75 52.5,44.5 34.05,43.85 34.05,40.2 38.3,46.9 42.9,37.7 41.5,41.5 37.01,10.02 51,51.2 47.75,46.5 43.5,46.75 46.55,33.45 10.3,47.5 1.9,51.1 8.1,22.6 10.3,15.2 10.3,26.3 25.7,31.5 25.8,29 20.1,31.4 25.6,20.3 32.9,11.7 15.4,4.6 26.25,4.05 17.7,15.3 39.9,20.1 41.7,28.2 39.9,12.2 29.95,23.35 14,36.4 29.9,20.4 26.3,46 16.6,34.1 27.25,32.87 31.27,32.87 35.3,32.87 8.8,10.2 8.8,7.5 8.7,4.9 5.8,4.7 1.9,2.1 5.85,25.1 24,6.3 23.4,18.3 8.8,12.7 24.77,38.35 10.29,31.37 39.88,35.05 42.88,19.91
  pour Top (rank 5): 1.27,1.76 53.34,1.76 53.34,51.81 1.27,51.81
  pour Bottom (rank 5): 1.27,1.76 53.34,1.76 53.34,51.81 1.27,51.81
  pour Route2 (rank 5): 1.27,1.76 53.34,1.76 53.34,51.81 1.27,51.81
  pour Route15 (rank 5): 1.27,1.76 53.34,1.76 53.34,51.81 1.27,51.81
HALL_EFFCT_IN
  Bottom 0.203: R20.2 10.61,32.26 7.63,32.26 6.16,33.73 X4.3
HARP_H2_CLOCK_OUT
  Bottom 0.203: IC2.4 44.99,30.58 45.47,30.1 45.47,28.45 46.05,27.86 X1.4
HARP_H2_RX  (via drill 0.35)
  Top 0.203: v40.36,7.09 40.33,7.12 IC8.22
  Bottom 0.203: v40.36,7.09 41.27,8.01 41.27,23.85 41.78,24.36 X1.3
HARP_H2_TX  (via drill 0.35)
  Top 0.203: IC8.23 35.02,9.17 38.03,9.17 38.67,9.8 v41.94,9.8
  Bottom 0.203: X1.2 42.35,20.86 41.94,20.46 v41.94,9.8
LED_STATE  (via drill 0.35)
  Top 0.203: IC8.36 31.37,17.03 30.73,16.39 v29.43,16.39 | v25.22,26.65 24.48,25.9 STATE.A
  Route2 0.203: v29.43,16.39 29.43,16.69 28.6,17.51 v28.6,26.6
  Route15 0.203: v28.6,26.6 25.27,26.6 v25.22,26.65
N$1
  Top 0.254: R3.2 49.48,37.78 49.85,38.16 49.85,40.51 X6.SHIELD_4
N$2
  Top 0.203: X6.P$2 48.22,43.6 47.75,43.41 46.98,43.09 IC7.P$4
N$3
  Top 0.203: X6.P$3 48.42,44.41 47.75,44.68 47.01,44.99 IC7.P$6
N$4
  cutout Bottom: 45.78,15.75 50.75,15.75 50.75,31 45.78,31
N$5
  cutout Route15: 45.78,15.75 50.75,15.75 50.75,31 45.78,31
N$6
  cutout Route2: 45.78,15.75 50.75,15.75 50.75,31 45.78,31
N$7
  cutout Top: 45.78,15.75 50.75,15.75 50.75,31 45.78,31
N$8
  cutout Bottom: 34.65,21 39.25,21 39.25,28.25 36.5,28.25 36.5,26.5 34.65,26.5
N$9
  Top 0.203: STATE.C 20.27,27.4 R1.2
N$10
  cutout Route15: 34.65,21 39.25,21 39.25,28.25 36.5,28.25 36.5,26.5 34.65,26.5
N$11
  Top 0.203: IC8.44 24.97,19.41 24.63,19.76 TP4.TP
N$12
  Top 0.203: IC8.1 21,16.92 TP5.TP
N$13
  Top 0.203: TP6.TP IC8.6
N$14
  cutout Route2: 34.65,21 39.25,21 39.25,28.25 36.5,28.25 36.5,26.5 34.65,26.5
N$15
  Top 0.254: X6.SHIELD_3 46.53,48.05 C2.1
N$16
  cutout Top: 34.5,21 39.25,21 39.25,28.25 36.5,28.25 36.5,26.5 34.75,26.5 34.75,28.25 34.75,27.25
N$17
  Top 0.203: IC8.11 20.81,8.92 TP8.TP
N$18
  Top 0.203: IC8.21 TP9.TP
N$19
  cutout Bottom: 1.2,2.65 5.2,2.65 5.2,13.6 1.2,13.6
N$20
  cutout Route15: 1.2,2.65 5.2,2.65 5.2,13.6 1.2,13.6
N$21
  cutout Route2: 1.2,2.65 5.2,2.65 5.2,13.6 1.2,13.6
N$22
  cutout Top: 1.2,2.65 5.2,2.65 5.2,13.6 1.2,13.6
N$23
  cutout Bottom: 1.25,17.55 5.25,17.55 5.25,28.7 1.25,28.7
N$24
  cutout Route15: 1.25,17.55 5.25,17.55 5.25,28.7 1.25,28.7
N$25
  cutout Route2: 1.25,17.55 5.25,17.55 5.25,28.7 1.25,28.7
N$26
  cutout Top: 1.25,17.55 5.25,17.55 5.25,28.7 1.25,28.7
N$27
  cutout Bottom: 1.1,32.6 5,32.6 5,38.5 1.1,38.5
N$28
  cutout Route15: 1.1,32.6 5,32.6 5,38.5 1.1,38.5
N$29
  cutout Route2: 1.1,32.6 5,32.6 5,38.5 1.1,38.5
N$30
  cutout Top: 1.1,32.6 5,32.6 5,38.5 1.1,38.5
N$31
  cutout Bottom: 1.1,42.7 5,42.7 5,46.1 1.1,46.1
N$32
  cutout Route15: 1.1,42.7 5,42.7 5,46.1 1.1,46.1
N$33
  cutout Route2: 1.1,42.7 5,42.7 5,46.1 1.1,46.1
N$34
  cutout Top: 1.1,42.7 5,42.7 5,46.1 1.1,46.1
N$35
  cutout Bottom: 43,3.25 50.25,3.25 50.25,9.75 43,9.75
N$36
  cutout Route15: 43,3.25 50.25,3.25 50.25,9.75 43,9.75
N$37
  cutout Route2: 43,3.25 50.25,3.25 50.25,9.75 43,9.75
N$38
  Top 0.203: IC1.17 35.33,46.98 C7.1
N$39
  cutout Top: 43,3.25 50.25,3.25 50.25,9.8 43,9.8
N$40
  cutout Bottom: 16,32.45 16,35.6 12.85,35.6 12.85,32.45
N$41
  cutout Route2: 29.8,24.1 33.25,24.1 33.25,27.65 29.8,27.65
N$42
  cutout Top: 29.8,24.1 33.95,24.1 33.95,27.65 31,27.65 31,26.25 29.8,26.25
N$43
  cutout Route15: 29.8,24.1 33.25,24.1 33.25,27.65 29.8,27.65
N$44
  cutout Bottom: 29.8,24.1 33.25,24.1 33.25,27.65 29.8,27.65
N$45
  cutout Top: 32.25,20 32.25,22.05 32,22.05 32,20
N$46
  cutout Top: 22.7,26.05 22.7,27.2 20.65,27.2 20.65,26.05
N$47
  cutout Top: 41.15,30.3 42.2,30.3 42.2,30.85 41.15,30.85
N$48
  cutout Top: 42.3,31.65 42.3,38.8 41.75,38.8 41.75,31.65
N$49
  cutout Top: 41.15,15.4 42.2,15.4 42.2,24.65 41.15,24.65
N$50
  Bottom 0.203: R17.2 C41.2 R19.1
N$51
  Bottom 0.203: R11.1 7.45,36.3 R10.1 3.43,36.2 X4.2
N$52
  cutout Top: 27.9,48.9 29.5,48.9 29.5,50.85 27.9,50.85
N$53
  cutout Top: 32.95,47.85 34.55,47.85 34.55,50.25 32.95,50.25
N$54
  cutout Top: 44.85,41.65 45.6,41.65 45.6,42.9 44.85,42.9
N$55
  cutout Top: 40.05,15.4 41.1,15.4 41.1,15.95 40.05,15.95
N$56
  cutout Top: 32.65,16.8 33.4,16.8 33.4,18.25 32.65,18.25
N$57
  cutout Top: 29.4,17.55 30.15,17.55 30.15,18.05 29.4,18.05
N$58
  cutout Top: 35.3,27.85 36.05,27.85 36.05,28.35 35.3,28.35
N$59
  cutout Top: 24.55,5.7 25.2,5.7 25.2,6.45 24.55,6.45
N$60
  cutout Top: 27,15.8 27.65,15.8 27.65,16.55 27,16.55
N$61
  cutout Top: 17.35,4.9 18,4.9 18,5.65 17.35,5.65
N$62
  Bottom 0.203: R9.1 24.02,25.3 | 24.02,25.3 23.73,25.3 C15.1 | R4.2 24.88,23.83 24.02,24.68 24.02,25.3
N$63  (via drill 0.35)
  Top 0.203: IC8.39 28.97,16.87 v28.4,16.3
  Bottom 0.203: v28.4,16.3 29,15.7 C16.1 30.65,14.9 L3.1
N$64
  Bottom 0.203: R17.1 15.51,35.05 IC10.4 14.65,34.95 14.2,34.5 14.2,33.4 13.85,33.05 IC10.1
N$65
  Bottom 0.203: R20.1 R21.2 10.8,34.95 IC10.3
N$66
  cutout Bottom: 37.01,32.77 37.01,30.99 40.39,30.99 40.39,32.77
N$103
  Top 0.203: R2.2 23.25,36.6 R5.2 21.72,40.33 20.82,41.24 X8.1
N$104
  Top 0.203: R5.1 24.55,43.94 C24.1 24.75,48.51 IC9.5
N$175
  Top 0.203: IC1.19 34.03,47.01 34.87,47.86 R18.2
OSC2
  Top 0.203: IC8.37 30.57,24.67 OSC1.P$3
PDI_CLK
  Top 0.203: R34.1 37.85,29.8 | 37.85,29.8 38.02,29.8 C13.1 38.16,29.72 SV2.5 | IC8.35 32.17,20.38 32.6,20.8 36.55,20.8 36.88,21.13 36.88,28.84 37.85,29.8
PDI_DATA
  Top 0.203: IC8.34 32.97,19.89 33.38,20.29 36.85,20.29 37.66,21.1 37.66,21.66 SV2.1
STEP_DIRECTION
  Top 0.203: T1.3 10.02,9.17 3.8,9.17 X5.3
  Bottom 0.203: R15.1 3.38,8.75 X5.3
STEP_ENABLE
  Top 0.203: T3.3 10.1,11.65 9.75,11.31 X5.2
  Bottom 0.203: R14.1 8.16,11.31 X5.2
STEP_PULSE
  Top 0.203: T2.3 3.4,6.44 X5.4
  Bottom 0.203: R16.1 3.43,6.2 X5.4
U_CLOCK_IN  (via drill 0.35)
  Top 0.203: X8.4 13.57,40.08 13.96,39.68 14.78,39.35 21.34,39.35 21.93,38.75 R2.1 21.93,35.43 v21.96,35.37 | IC8.12 v21.94,7.12
  Route2 0.203: v21.96,35.37 21.96,7.14 v21.94,7.12
  Route15 0.203: v21.96,35.37 22.19,35.14 38.82,35.14 v38.86,35.1
  Bottom 0.203: v38.86,35.1 IC2.2
U_ENCODER_A_PHASE  (via drill 0.35)
  Top 0.203: v16.05,3.25 16.07,3.27 26.77,3.27 27.37,3.87 IC8.15 | IC12.4 16.01,18.54 v16.05,18.5
  Bottom 0.203: v16.05,18.5 v16.05,3.25
U_ENCODER_B_PHASE  (via drill 0.35)
  Top 0.203: v16.85,4.8 26.4,4.8 26.57,4.97 IC8.14 | IC11.4 v16.85,23.75
  Bottom 0.203: v16.85,23.75 v16.86,23.74 v16.86,4.81 v16.85,4.8
U_HALL_EFFCT_IN  (via drill 0.35)
  Top 0.203: IC8.41 27.37,17.12 26.95,16.7 v26.6,16.7
  Route2 0.203: v26.6,16.7 26.6,32.9 26,33.5 v26,34.4
  Bottom 0.203: R19.2 C42.2 25.55,34.4 v26,34.4
U_STEP_DIRECTION  (via drill 0.35)
  Top 0.203: T1.1 14.07,8.57 R12.2 14.35,8.65 15.36,8.65 v15.36,8.6 | v28.19,8.61 28.19,7.17 IC8.16
  Route15 0.203: v28.19,8.61 15.37,8.61 v15.36,8.6
U_STEP_ENABLE
  Top 0.203: T3.1 11.97,12.08 14.15,12.08 R13.2 15.42,12.18 15.7,11.9 15.7,10 16.01,9.69 17.85,9.69 17.88,9.72 IC8.10
U_STEP_PULSE
  Top 0.203: T2.1 12.02,5.67 14.05,5.67 R6.2 25.47,5.47 25.8,5.8 25.8,7.1 IC8.13
USB_POWER  (via drill 0.35)
  Top 0.203: v46.86,44.03 46.85,44.04 IC7.P$5
  Top 0.305: L1.2 45.06,39.53 C3.1 45.16,41.47 45.63,41.94 v46.84,41.94 47.25,41.94 48.07,42.76 49.19,42.76 X6.P$1
  Bottom 0.203: v46.86,44.03 46.86,41.96 v46.84,41.94
USBDM
  Top 0.203: IC7.P$3 39.39,43.09 C4.1 36.52,43.1 35.98,43.64 IC1.16
USBDP
  Top 0.203: IC1.15 36.63,45.12 39.36,45.12 C6.1 39.5,44.99 IC7.P$1
V+  (via drill 0.35)
  Top 0.203: IC8.19 30.57,4.06 | 30.57,4.06 C28.1 | IC8.31 38.06,15.32 C26.1 | IC8.9 C29.1 18.73,10.52 v18.3,10.95 | C27.1 28.9,22.13 27.33,22.13 v27.3,22.1 | 40.15,17.98 L2.1 38.61,17.98 v38.49,18.1 | 40.15,17.98 39.84,17.67 39.84,15.57 39.58,15.32 39.12,15.32 | C26.1 39.12,15.32 | v38.1,4.19 37.98,4.06 30.57,4.06 | SV2.2 35.2,21.98 C25.1 32.78,22 32.78,24.68 OSC1.P$4 33.81,24.92 34.26,25.36 R34.2 | v38.86,12.11 38.86,15.07 39.12,15.32 | 40.15,17.98 39.88,18.25 39.88,18.52 39.37,19.03 v38.06,19.03 | C26.1 38.05,16.53 v38.92,17.4 v38.91,17.4 v38,17.4
  Route2 0.203: v37.04,46.97 37.08,46.93 37.08,18.61 37.59,18.1 v38.49,18.1
  Route15 0.203: v18.3,10.95 38.21,10.95 38.86,11.61 v38.86,12.11 | v38.49,18.1 37.99,18.6 27.9,18.6 27.3,19.2 v27.3,22.1 | v38.06,19.03 36.07,19.03 35.62,19.48 SV2.2 | v37.04,46.97 37.03,46.96 10.97,46.96 v10.17,46.16
  Bottom 0.203: v38.1,4.19 v38.09,4.19 38.09,14.97 38.92,15.8 v38.92,17.4 | v10.17,46.16 10.17,44.08 R8.2 | v38,17.4 38,15.55 37.65,15.2 L3.2 | R9.2 27.3,25.25 v27.3,22.1
  pour Route2: 37.5,19.54 39.33,19.54 39.33,16.74 37.5,16.74
  pour Route15: 37.5,19.54 39.33,19.54 39.33,16.74 37.5,16.74
  pour Bottom: 37.5,19.54 39.33,19.54 39.33,16.74 37.5,16.74
  pour Top: 37.5,19.54 39.33,19.54 39.33,16.74 37.5,16.74
VDD
  Bottom 0.356: X1.1 47.89,17.36 45.69,15.16 44.26,15.16 43.43,14.34 43.43,7.47 X7.P1

### Text on the board
tPlace: H2-module / Harp Motor device / v.1.0
tNames: EMERGENCY | CLKIN | HALL EFFECT | GND / IN / V+ | ROTARY ENCODER | CLK / OUT | GND / PH_A / PH_B / N.C. / V+ | GND / / / / RX / / TX / / V+ | STEP MOTOR | PULSE | GND / ENB / DIR / / V+ | POWER
tTest: camm_trigg_1 | camm_trigg_2 | lick_port_1 | lick_port_2 | reward_valve_1 | reward_valve_2 | Optical_flow_1 | Optical_flow_2